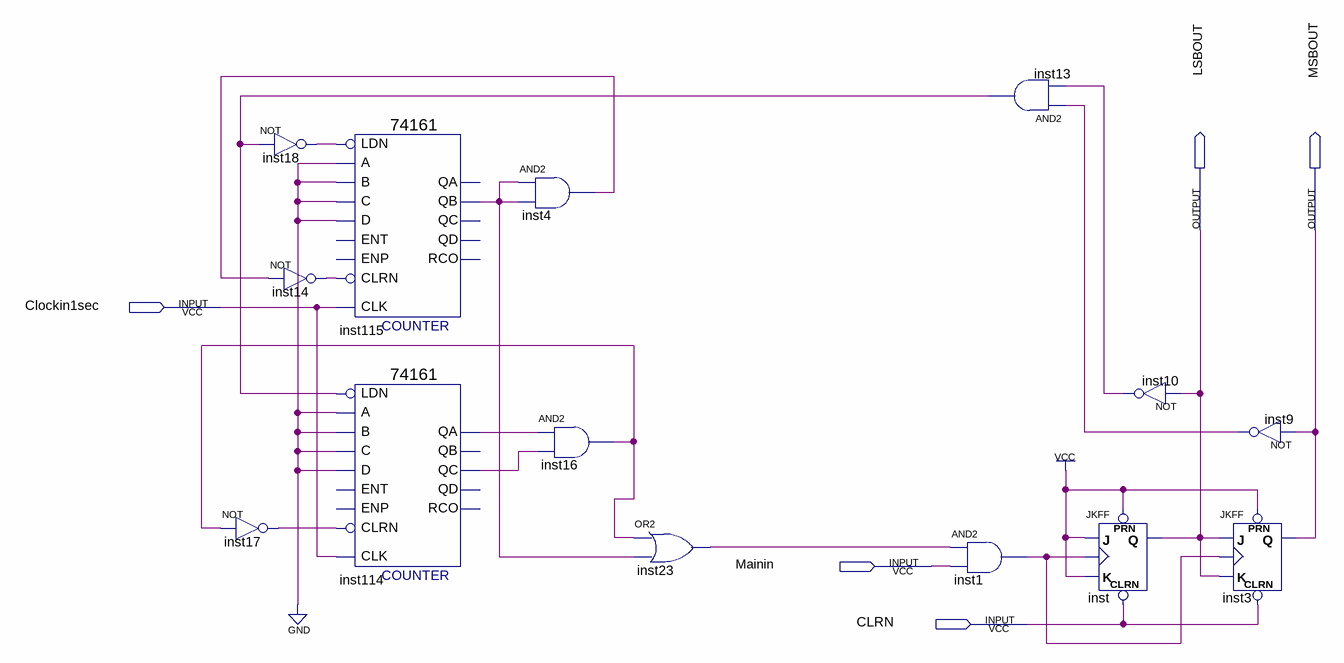
[diagram p0: schematic sheet]
// Quartus schematic MaquinadeStateMain.bdf as structural Verilog: 14 symbols, 5 pins
module MaquinadeStateMain (
  input  Clockin1sec,
  input  Mainin,
  input  CLRN,
  output LSBOUT,
  output MSBOUT
);

  wire inst1_out, inst4_out, inst9_out, inst10_out, inst13_out, inst14_out, inst16_out, inst17_out,
       inst18_out, inst23_out, inst114_qa, inst114_qc, inst115_qb;

  not inst17 (inst17_out, inst16_out);
  not inst18 (inst18_out, inst13_out);
  not inst14 (inst14_out, inst4_out);
  \74161  inst115 (
    .CLRN(inst14_out), .CLK(Clockin1sec), .LDN(inst18_out), .A(1'b0), .D(1'b0), .B(1'b0), .C(1'b0),
    .QB(inst115_qb));  // open: ENP, ENT, QD, QC, QA, RCO
  \74161  inst114 (
    .CLRN(inst17_out), .CLK(Clockin1sec), .LDN(inst13_out), .A(1'b0), .D(1'b0), .B(1'b0), .C(1'b0),
    .QC(inst114_qc), .QA(inst114_qa));  // open: ENP, ENT, QD, QB, RCO
  and inst4 (inst4_out, inst115_qb, inst115_qb);
  and inst16 (inst16_out, inst114_qa, inst114_qc);
  or inst23 (inst23_out, inst16_out, inst115_qb);
  and inst13 (inst13_out, inst9_out, inst10_out);
  and inst1 (inst1_out, inst23_out, Mainin);
  JKFF inst (.PRN(1'b1), .CLRN(CLRN), .K(1'b1), .J(1'b1), .CLK(inst1_out), .Q(LSBOUT));
  not inst10 (inst10_out, LSBOUT);
  not inst9 (inst9_out, MSBOUT);
  JKFF inst3 (.PRN(1'b1), .CLRN(CLRN), .K(LSBOUT), .J(LSBOUT), .CLK(inst1_out), .Q(MSBOUT));
endmodule
